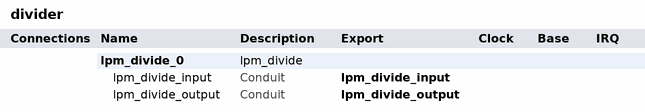
[diagram p0: system contents]
# Platform Designer (Qsys) system divider, Arria 10 10AX115U4F45I3VG
# Parameters at their usual value, and those the tool derives, are not listed.
package require qsys
create_system divider
set_project_property DEVICE_FAMILY {Arria 10}
set_project_property DEVICE 10AX115U4F45I3VG

add_instance lpm_divide_0 lpm_divide 20.1
set_instance_property lpm_divide_0 AUTO_EXPORT true
set_instance_parameter_value lpm_divide_0 GUI_LPM_PIPELINE 10
set_instance_parameter_value lpm_divide_0 GUI_LPM_REMAINDERPOSITIVE Yes
set_instance_parameter_value lpm_divide_0 GUI_LPM_WIDTHd 16
set_instance_parameter_value lpm_divide_0 GUI_LPM_WIDTHn 36
set_instance_parameter_value lpm_divide_0 GUI_LPM_dREPRESENTATION Unsigned
set_instance_parameter_value lpm_divide_0 GUI_LPM_nREPRESENTATION Unsigned
set_instance_parameter_value lpm_divide_0 GUI_MAXIMIZE_SPEED {Default Optimization}
set_instance_parameter_value lpm_divide_0 GUI_USE_ACLR false
set_instance_parameter_value lpm_divide_0 GUI_USE_CLKEN false

# exported interfaces
add_interface lpm_divide_input conduit end
set_interface_property lpm_divide_input EXPORT_OF lpm_divide_0.lpm_divide_input
add_interface lpm_divide_output conduit end
set_interface_property lpm_divide_output EXPORT_OF lpm_divide_0.lpm_divide_output

set_interconnect_requirement {$system} qsys_mm.clockCrossingAdapter HANDSHAKE
set_interconnect_requirement {$system} qsys_mm.enableEccProtection FALSE
set_interconnect_requirement {$system} qsys_mm.insertDefaultSlave FALSE
set_interconnect_requirement {$system} qsys_mm.maxAdditionalLatency 1

save_system divider.qsys
